# Altium schematic sheet Interface.SchDoc
size A
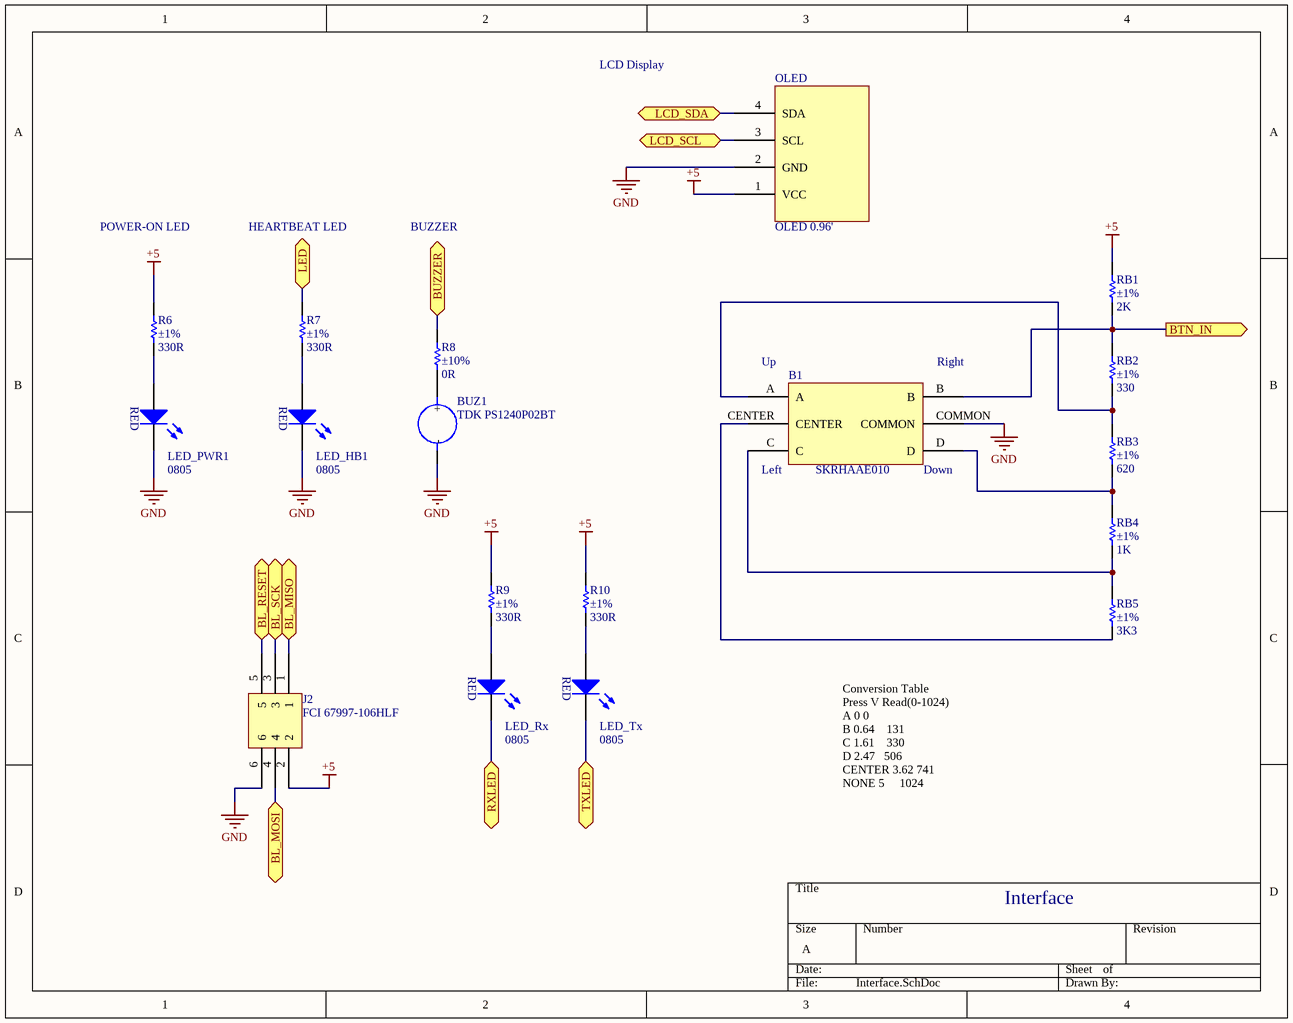
[diagram p0: Interface.SchDoc]

## Parts
B1  SKRHAAE010  [PCB-uddfpa39w3pawwu0f32n-1]
BUZ1  TDK PS1240P02BT  [2P-7.6-D12X6.5H]
J2  FCI 67997-106HLF  [PCB-94q9r8plw7fzhg0k9c12-1]
LED_HB1  Case/Package: 0805  [LED0805]  (hidden comment: CMP-7f15b6173d91a0d2-5)
LED_PWR1  Case/Package: 0805  [LED0805]  (hidden comment: CMP-7f15b6173d91a0d2-5)
LED_Rx  Case/Package: 0805  [LED0805]  (hidden comment: CMP-7f15b6173d91a0d2-5)
LED_Tx  Case/Package: 0805  [LED0805]  (hidden comment: CMP-7f15b6173d91a0d2-5)
OLED  OLED 0.96'  [PCBComponent_1 - duplicate]
R6  Resistance Tolerance: ±1%  Resistance: 330R  [PCB-4097432-1]  (hidden comment: Bourns CR0805-FX-4701GLF)
R7  Resistance Tolerance: ±1%  Resistance: 330R  [PCB-4097432-1]  (hidden comment: Bourns CR0805-FX-4701GLF)
R8  Resistance Tolerance: ±10%  Resistance: 0R  [PCB-4097432-1]  (hidden comment: Bourns CR0805-FX-4701GLF)
R9  Resistance Tolerance: ±1%  Resistance: 330R  [PCB-4097432-1]  (hidden comment: Bourns CR0805-FX-4701GLF)
R10  Resistance Tolerance: ±1%  Resistance: 330R  [PCB-4097432-1]  (hidden comment: Bourns CR0805-FX-4701GLF)
RB1  Resistance Tolerance: ±1%  Resistance: 2K  [PCB-4097432-1]  (hidden comment: Bourns CR0805-FX-4701GLF)
RB2  Resistance Tolerance: ±1%  Resistance: 330  [PCB-4097432-1]  (hidden comment: Bourns CR0805-FX-4701GLF)
RB3  Resistance Tolerance: ±1%  Resistance: 620  [PCB-4097432-1]  (hidden comment: Bourns CR0805-FX-4701GLF)
RB4  Resistance Tolerance: ±1%  Resistance: 1K  [PCB-4097432-1]  (hidden comment: Bourns CR0805-FX-4701GLF)
RB5  Resistance Tolerance: ±1%  Resistance: 3K3  [PCB-4097432-1]  (hidden comment: Bourns CR0805-FX-4701GLF)

## Ports
BL_MISO, BL_MOSI, BL_RESET, BL_SCK, BTN_IN (out), BUZZER (bidir), LCD_SCL (bidir), LCD_SDA (bidir), LED (bidir), RXLED (bidir), TXLED (bidir)

## Nets
+5: J2.2 OLED.1(VCC) R6.2 R9.2 R10.2 RB1.2
GND: B1.COMMON BUZ1.- J2.6 LED_HB1.1(K) LED_PWR1.1(K) OLED.2(GND)
BL_MISO: J2.1 ; port BL_MISO
BL_MOSI: J2.4 ; port BL_MOSI
BL_RESET: J2.5 ; port BL_RESET
BL_SCK: J2.3 ; port BL_SCK
BTN_IN: B1.B RB1.1 RB2.2 ; port BTN_IN
BUZZER: R8.2 ; port BUZZER
LCD_SCL: OLED.3(SCL) ; port LCD_SCL
LCD_SDA: OLED.4(SDA) ; port LCD_SDA
LED: R7.2 ; port LED
RXLED: LED_Rx.1(K) ; port RXLED
TXLED: LED_Tx.1(K) ; port TXLED
NetB1_A: B1.A RB2.1 RB3.2
NetB1_C: B1.C RB4.1 RB5.2
NetB1_CENTER: B1.CENTER RB5.1
NetB1_D: B1.D RB3.1 RB4.2
NetBUZ1_+: BUZ1.+ R8.1
NetLED_HB1_2: LED_HB1.2(A) R7.1
NetLED_PWR1_2: LED_PWR1.2(A) R6.1
NetLED_Rx_2: LED_Rx.2(A) R9.1
NetLED_Tx_2: LED_Tx.2(A) R10.1

## Notes on the sheet
- LCD Display
- POWER-ON LED
- HEARTBEAT LED
- BUZZER
- (near B1) Up
- (near B1) Right
- (near B1) Left
- (near B1) Down
- Conversion Table
  Press	V	Read(0-1024)
  A	0	0
  B	0.64   	131
  C	1.61   	330
  D	2.47  	506
  CENTER	3.62	741
  NONE	5    	1024
- Interface
- (in symbol CMP-7f15b6173d91a0d2-5) RED

## Library data of the parts
B1 = CMP-0t5k0v9upau5edea4oo5-8: TACT switch 4-direction with Center-Push Function (Surface Mount); CustomComponentID: 0t5k0v9upau5edea4oo5
BUZ1 = PS1240P02BT: Audio Indicator Buzzer Piezo 3Vo-p Pin Through Hole; Lead-Free Status: Lead Free; RoHS: Compliant; Octopart Url: http://octopart.com/ps1240p02bt-tdk-8602108; Seller Landing  Url: https://octopart-clicks.com/click/track?country=US&ak=8157f166&sig=0ee4d25&sid=5489&ppid=8602108&vpid=52084698&ct=offers; Manufacturer Part Number: PS1240P02BT; OctopartID: 93c85a41f7524c0f
J2 = CMP-c8f30399bb8b1734-1: Conn; Rect; Header; Unshrouded; 6 Pos; 2.54mm Pitch; 2-Row; Thru-Hole; BergStik; Number of Positions: 6; Gender: Male; Lead-Free Status: Lead Free; Contact Plating: Gold; RoHS: Compliant; Contact Material: Phosphor Bronze; Mounting Style: Through Hole; Pin Pitch: 2.54 mm; Number of Rows: 2; Number of Contacts: 6; Octopart URL: http://octopart.com/67997-106hlf-fci-39867934; OctopartID: c8f30399bb8b1734; Manufacturer Part Number: 67997-106HLF
LED_HB1 LED_PWR1 LED_Rx LED_Tx = CMP-7f15b6173d91a0d2-5: LED; SMD; 0805; red; 7.2-17mcd; 2x1.25mm; 170°; 1.8÷2.6V; 20mA; Manufacturer Part Number: HSMH-C170; Lead-Free Status: Lead Free; Lens Type: Diffused; Power Dissipation: 0.065 W; Voltage Rating (DC): 1.8 V; Luminous Intensity: 0.017 cd; Lens Color: Clear; Peak Wavelength: 6.6e-07 m; Wavelength: 6.39e-07 m; Case/Package (SI): 2012; RoHS: Compliant; Number of Pins: 2; Forward Voltage: 1.8 V; Packaging: Cut Tape (CT); Viewing Angle: 170 °; Octopart URL: http://octopart.com/hsmh-c170-avago-550882; REACH SVHC Compliance: No SVHC; Order Code (RS Components): 486-0468; Color: Red; OctopartID: 7f15b6173d91a0d2; Lifecycle Status: Active; Mounting Style: Surface Mount, Vertical; Part Description: *
OLED = CMP-am4xhbx8j6fw9q56sa5u-8: 0.96' oled i2c screen; CustomComponentID: am4xhbx8j6fw9q56sa5u
R6-R10 RB1-RB5 = CMP-97505e06006c4897-1: Res Thick Film 0805 4.7K Ohm 1% 1/8W ±100ppm/°C Molded SMD SMD Paper Tape on Plastic Reel; Voltage Rating (DC): 150 V; Power Rating: 125 mW; Manufacturer Part Number: CR0805-FX-4701GLF; REACH SVHC Compliance: No SVHC; OctopartID: 97505e06006c4897; Packaging: Tape & Reel (TR), Cut Tape (CT); Octopart URL: http://octopart.com/cr0805-fx-4701glf-bourns-6074970; Number of Pins: 2; Mounting Style: Surface Mount; RoHS: Compliant; Size-Thickness: 508 µm; Size-Length: 2.01 mm; Case/Package: 0805; Size-Width: 1.24 mm